# EAGLE design shield-obr (EAGLE 9.6.2)
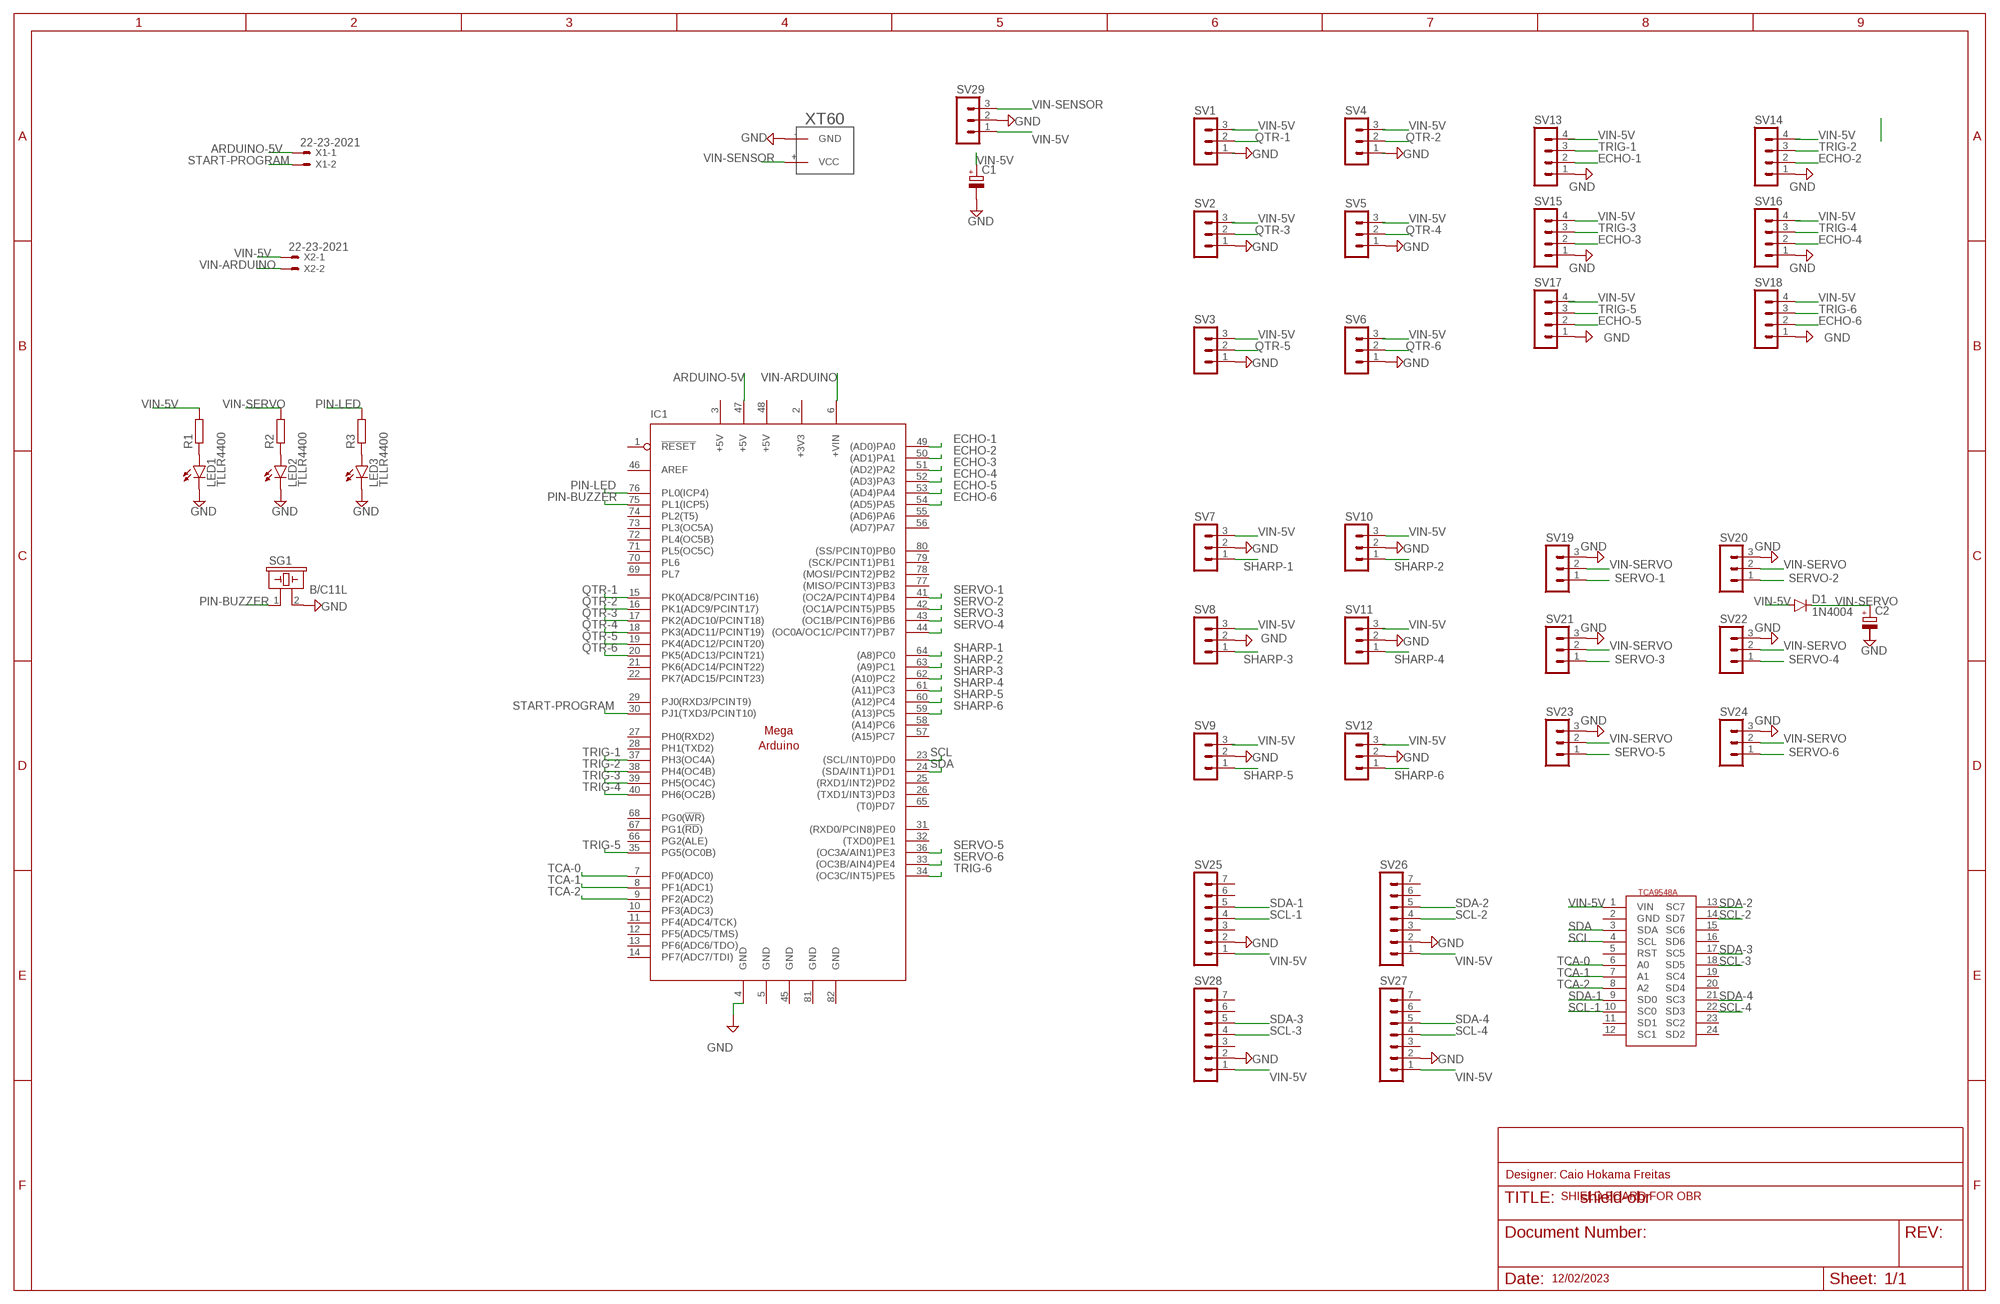
[diagram p0: schematic, sheet 1]

## Parts
C1  CPOL-EUE2.5-5  [E2,5-5]
C2  CPOL-EUE2.5-5  [E2,5-5]
D1  1N4004  [DO41-10]
IC1  MEGAARDUINO_1  [MEGA_ARDUINO]
LED1  TLLR4400  [LED3MM]
LED2  TLLR4400  [LED3MM]
LED3  TLLR4400  [LED3MM]
R1  R-EU_0207/10  [0207/10]
R2  R-EU_0207/10  [0207/10]
R3  R-EU_0207/10  [0207/10]
SG1  B/C11L  [B/C11L]
SV1  MA03-1  [MA03-1]
SV2  MA03-1  [MA03-1]
SV3  MA03-1  [MA03-1]
SV4  MA03-1  [MA03-1]
SV5  MA03-1  [MA03-1]
SV6  MA03-1  [MA03-1]
SV7  MA03-1  [MA03-1]
SV8  MA03-1  [MA03-1]
SV9  MA03-1  [MA03-1]
SV10  MA03-1  [MA03-1]
SV11  MA03-1  [MA03-1]
SV12  MA03-1  [MA03-1]
SV13  MA04-1  [MA04-1]
SV14  MA04-1  [MA04-1]
SV15  MA04-1  [MA04-1]
SV16  MA04-1  [MA04-1]
SV17  MA04-1  [MA04-1]
SV18  MA04-1  [MA04-1]
SV19  MA03-1  [MA03-1]
SV20  MA03-1  [MA03-1]
SV21  MA03-1  [MA03-1]
SV22  MA03-1  [MA03-1]
SV23  MA03-1  [MA03-1]
SV24  MA03-1  [MA03-1]
SV25  MA07-1  [MA07-1]
SV26  MA07-1  [MA07-1]
SV27  MA07-1  [MA07-1]
SV28  MA07-1  [MA07-1]
SV29  MA03-1  [MA03-1]
U$2  XT60  [XT60]
U$3  TCA9548A  [TCA9548A]
X1  22-23-2021  [22-23-2021]
X2  22-23-2021  [22-23-2021]

## Nets
ARDUINO-5V: IC1.47(+5V) X1.1
ECHO-1: IC1.49((AD0)PA0) SV13.2
ECHO-2: IC1.50((AD1)PA1) SV14.2
ECHO-3: IC1.51((AD2)PA2) SV15.2
ECHO-4: IC1.52((AD3)PA3) SV16.2
ECHO-5: IC1.53((AD4)PA4) SV17.2
ECHO-6: IC1.54((AD5)PA5) SV18.2
GND: C1.- IC1.4(GND) LED1.K(C) LED2.K(C) LED3.K(C) SG1.2 SV1.1 SV2.1 SV3.1 SV4.1 SV5.1 SV6.1 SV7.2 SV8.2 SV9.2 SV10.2 SV11.2 SV12.2 SV13.1 SV14.1 SV15.1 SV16.1 SV17.1 SV18.1 SV19.3 SV20.3 SV21.3 SV22.3 SV23.3 SV24.3 SV25.2 SV26.2 SV27.2 SV28.2 SV29.2 U$2.-(GND)
N$1: LED1.A R1.1
N$2: LED2.A R2.1
N$3: LED3.A R3.1
PIN-BUZZER: IC1.75(PL1(ICP5)) SG1.1
PIN-LED: IC1.76(PL0(ICP4)) R3.2
QTR-1: IC1.15(PK0(ADC8/PCINT16)) SV1.2
QTR-2: IC1.16(PK1(ADC9/PCINT17)) SV4.2
QTR-3: IC1.17(PK2(ADC10/PCINT18)) SV2.2
QTR-4: IC1.18(PK3(ADC11/PCINT19)) SV5.2
QTR-5: IC1.19(PK4(ADC12/PCINT20)) SV3.2
QTR-6: IC1.20(PK5(ADC13/PCINT21)) SV6.2
SCL: IC1.23((SCL/INT0)PD0) U$3.4(SCL)
SCL-1: SV25.4 U$3.10(SC0)
SCL-2: SV26.4 U$3.14(SD7)
SCL-3: SV28.4 U$3.18(SD5)
SCL-4: SV27.4 U$3.22(SD3)
SDA: IC1.24((SDA/INT1)PD1) U$3.3(SDA)
SDA-1: SV25.5 U$3.9(SD0)
SDA-2: SV26.5 U$3.13(SC7)
SDA-3: SV28.5 U$3.17(SC5)
SDA-4: SV27.5 U$3.21(SC3)
SERVO-1: IC1.41((OC2A/PCINT4)PB4) SV19.1
SERVO-2: IC1.42((OC1A/PCINT5)PB5) SV20.1
SERVO-3: IC1.43((OC1B/PCINT6)PB6) SV21.1
SERVO-4: IC1.44((OC0A/OC1C/PCINT7)PB7) SV22.1
SERVO-5: IC1.36((OC3A/AIN1)PE3) SV23.1
SERVO-6: IC1.33((OC3B/AIN4)PE4) SV24.1
SHARP-1: IC1.64((A8)PC0) SV7.1
SHARP-2: IC1.63((A9)PC1) SV10.1
SHARP-3: IC1.62((A10)PC2) SV8.1
SHARP-4: IC1.61((A11)PC3) SV11.1
SHARP-5: IC1.60((A12)PC4) SV9.1
SHARP-6: IC1.59((A13)PC5) SV12.1
START-PROGRAM: IC1.30(PJ1(TXD3/PCINT10)) X1.2
TCA-0: IC1.7(PF0(ADC0)) U$3.6(A0)
TCA-1: IC1.8(PF1(ADC1)) U$3.7(A1)
TCA-2: IC1.9(PF2(ADC2)) U$3.8(A2)
TRIG-1: IC1.37(PH3(OC4A)) SV13.3
TRIG-2: IC1.38(PH4(OC4B)) SV14.3
TRIG-3: IC1.39(PH5(OC4C)) SV15.3
TRIG-4: IC1.40(PH6(OC2B)) SV16.3
TRIG-5: IC1.35(PG5(OC0B)) SV17.3
TRIG-6: IC1.34((OC3C/INT5)PE5) SV18.3
VIN-5V: C1.+ D1.A R1.2 SV1.3 SV2.3 SV3.3 SV4.3 SV5.3 SV6.3 SV7.3 SV8.3 SV9.3 SV10.3 SV11.3 SV12.3 SV13.4 SV14.4 SV15.4 SV16.4 SV17.4 SV18.4 SV25.1 SV26.1 SV27.1 SV28.1 SV29.1 U$3.1(VIN) X2.1
VIN-ARDUINO: IC1.6(+VIN) X2.2
VIN-SENSOR: SV29.3 U$2.+(VCC)
VIN-SERVO: C2.+ D1.C R2.2 SV19.2 SV20.2 SV21.2 SV22.2 SV23.2 SV24.2
Unconnected: C2.- IC1.1(!RESET) IC1.10(PF3(ADC3)) IC1.11(PF4(ADC4/TCK)) IC1.12(PF5(ADC5/TMS)) IC1.13(PF6(ADC6/TDO)) IC1.14(PF7(ADC7/TDI)) IC1.21(PK6(ADC14/PCINT22)) IC1.22(PK7(ADC15/PCINT23)) IC1.25((RXD1/INT2)PD2) IC1.26((TXD1/INT3)PD3) IC1.27(PH0(RXD2)) IC1.28(PH1(TXD2)) IC1.29(PJ0(RXD3/PCINT9)) IC1.31((RXD0/PCIN8)PE0) IC1.32((TXD0)PE1) IC1.46(AREF) IC1.55((AD6)PA6) IC1.56((AD7)PA7) IC1.57((A15)PC7) IC1.58((A14)PC6) IC1.65((T0)PD7) IC1.66(PG2(ALE)) IC1.67(PG1(!RD!)) IC1.68(PG0(!WR!)) IC1.69(PL7) IC1.70(PL6) IC1.71(PL5(OC5C)) IC1.72(PL4(OC5B)) IC1.73(PL3(OC5A)) IC1.74(PL2(T5)) IC1.77((MISO/PCINT3)PB3) IC1.78((MOSI/PCINT2)PB2) IC1.79((SCK/PCINT1)PB1) IC1.80((SS/PCINT0)PB0) SV25.3 SV25.6 SV25.7 SV26.3 SV26.6 SV26.7 SV27.3 SV27.6 SV27.7 SV28.3 SV28.6 SV28.7 U$3.2(GND) U$3.5(RST) U$3.11(SD1) U$3.12(SC1) U$3.15(SC6) U$3.16(SD6) U$3.19(SC4) U$3.20(SD4) U$3.23(SC2) U$3.24(SD2)

## Notes on the sheet
- Designer: Caio Hokama Freitas
- SHIELD BOARD FOR OBR
- 12/02/2023

## Power pins joined to a net without a drawn wire
+3V3: IC1.2(+3V3)
+5V: IC1.3(+5V) IC1.48(+5V)
GND: IC1.5(GND) IC1.45(GND) IC1.81(GND) IC1.82(GND)

## Library data of the parts
C1 C2 = rcl:CPOL-EU: POLARIZED CAPACITOR, European symbol; SPICEPREFIX: C
D1 = diode:1N4004: DIODE general purpose rectifier, 1 A
IC1 = arduino:MEGAARDUINO_1: The Arduino Mega is a microcontroller board based on the ATmega1280. - 54 digital input/output pins (of which 14 can be used as PWM outputs) - 16 analog inputs - 4 UARTs (hardware serial ports) - 16 MHz crystal oscillator - USB connection - power jack - ICSP header - reset button It contains everything needed to support the microcontroller; simply connect it to a computer with a USB cable or power it with a AC-to-DC adapter or battery to get started. The Mega is compatible with most shields designed for the Arduino Duemilanove or Diecimila. http://arduino.cc/en/Main/ArduinoBoardMega
LED1-LED3 = led:TLLR4400: Low Current (2mA) LED 3 mm Tinted Diffused Package color RED Source: Data sheet <http://www.farnell.com/datasheets/391100.pdf>; MF: VISHAY SEMICONDUCTOR; OC_FARNELL: 1612437
R1-R3 = rcl:R-EU_: RESISTOR, European symbol; SPICEPREFIX: R
SG1 = buzzer:B/C11L: BUZZER Source: Buerklin; OC_FARNELL: unknown; OC_NEWARK: unknown
SV1-SV12 SV19-SV24 SV29 = con-lstb:MA03-1: PIN HEADER; OC_FARNELL: unknown; OC_NEWARK: unknown
SV13-SV18 = con-lstb:MA04-1: PIN HEADER; OC_FARNELL: unknown; OC_NEWARK: unknown
SV25-SV28 = con-lstb:MA07-1: PIN HEADER; OC_FARNELL: unknown; OC_NEWARK: unknown
U$2 = XT60:XT60: XT60
U$3 = TCA9548A:TCA9548A
X1 X2 = con-molex:22-23-2021: .100" (2.54mm) Center Header - 2 Pin; MF: MOLEX; MPN: 22-23-2021; OC_FARNELL: 1462926; OC_NEWARK: 25C3832

## Board
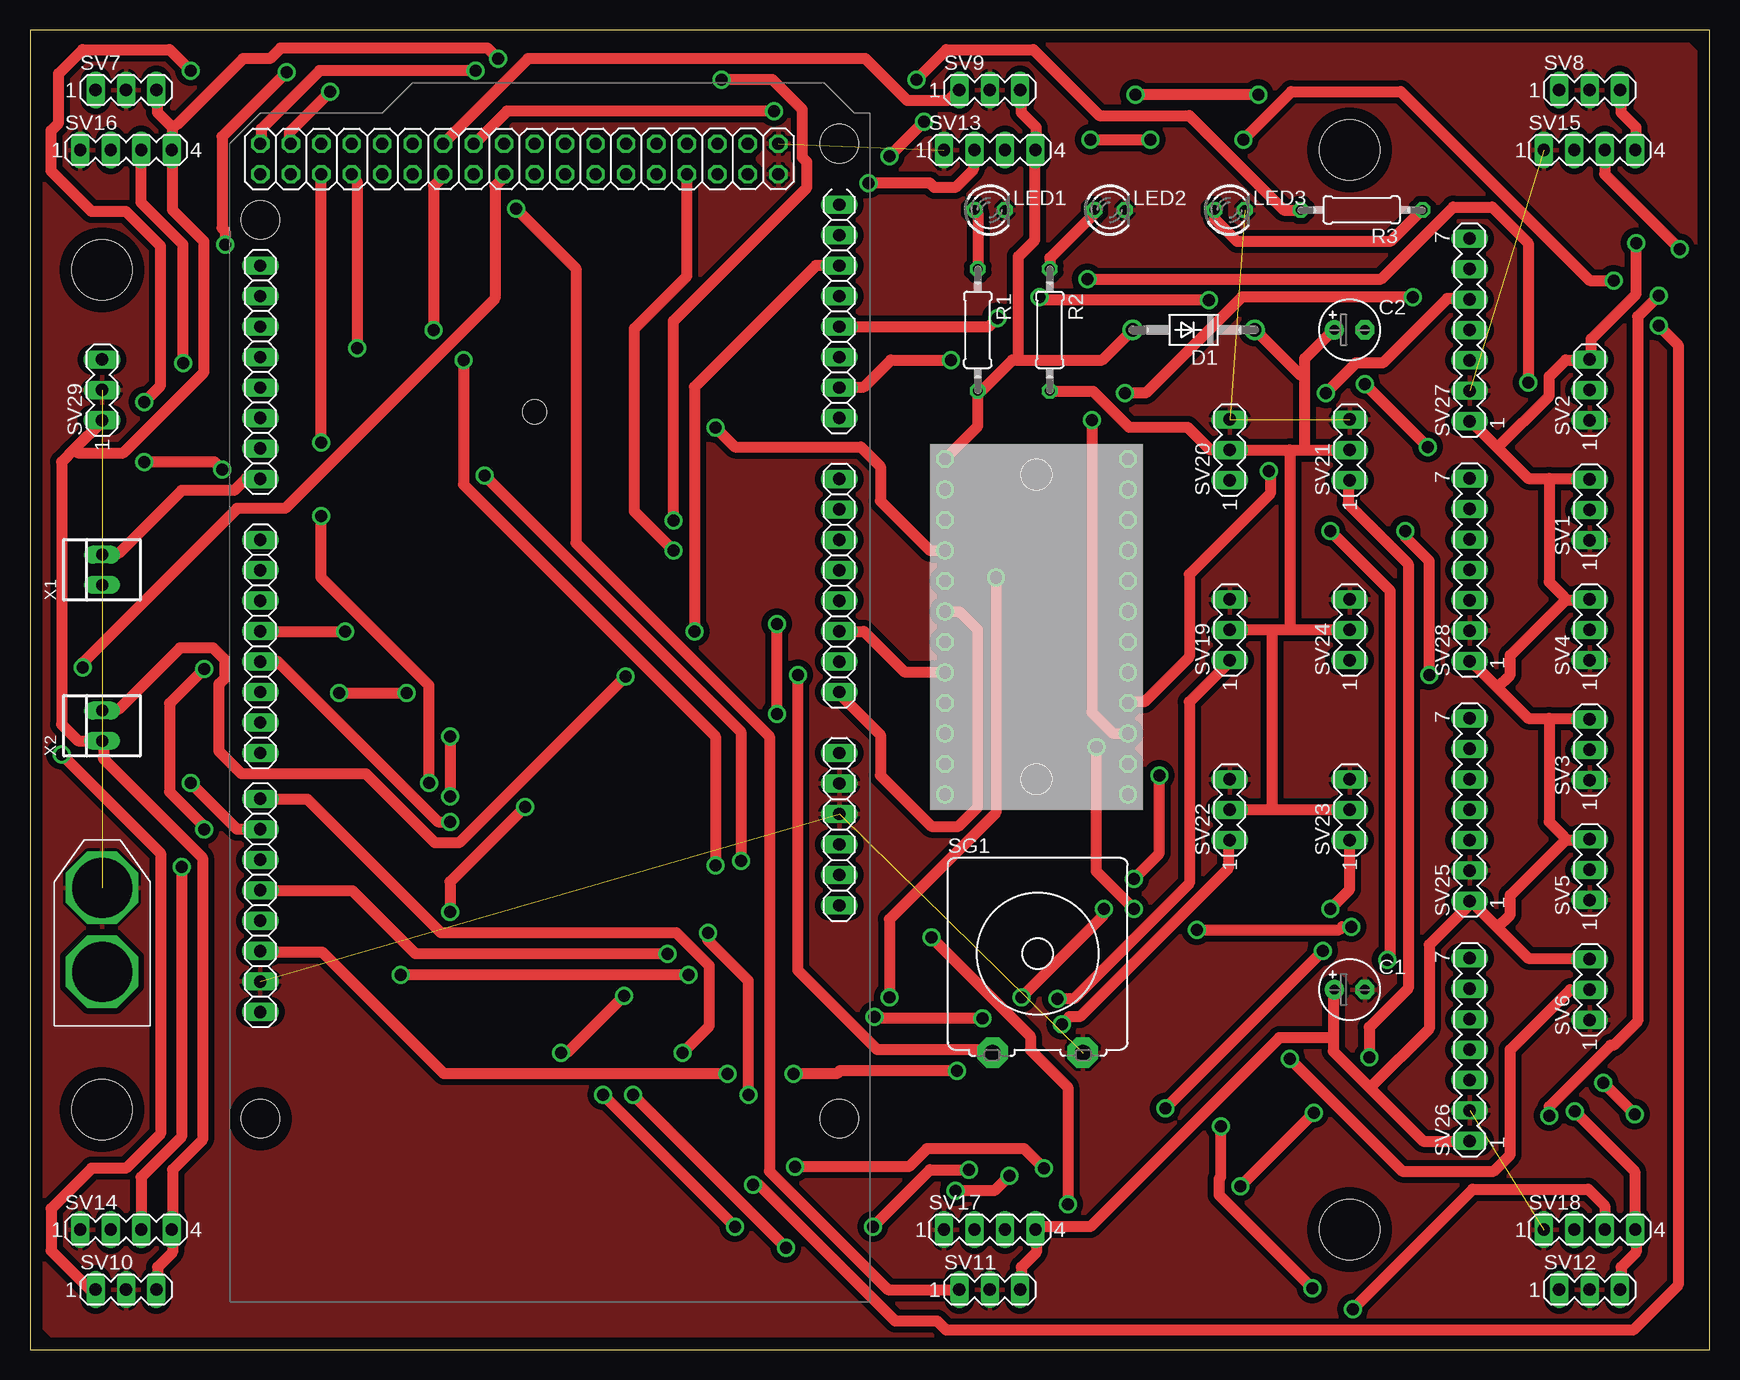
[diagram p1: board, top side]
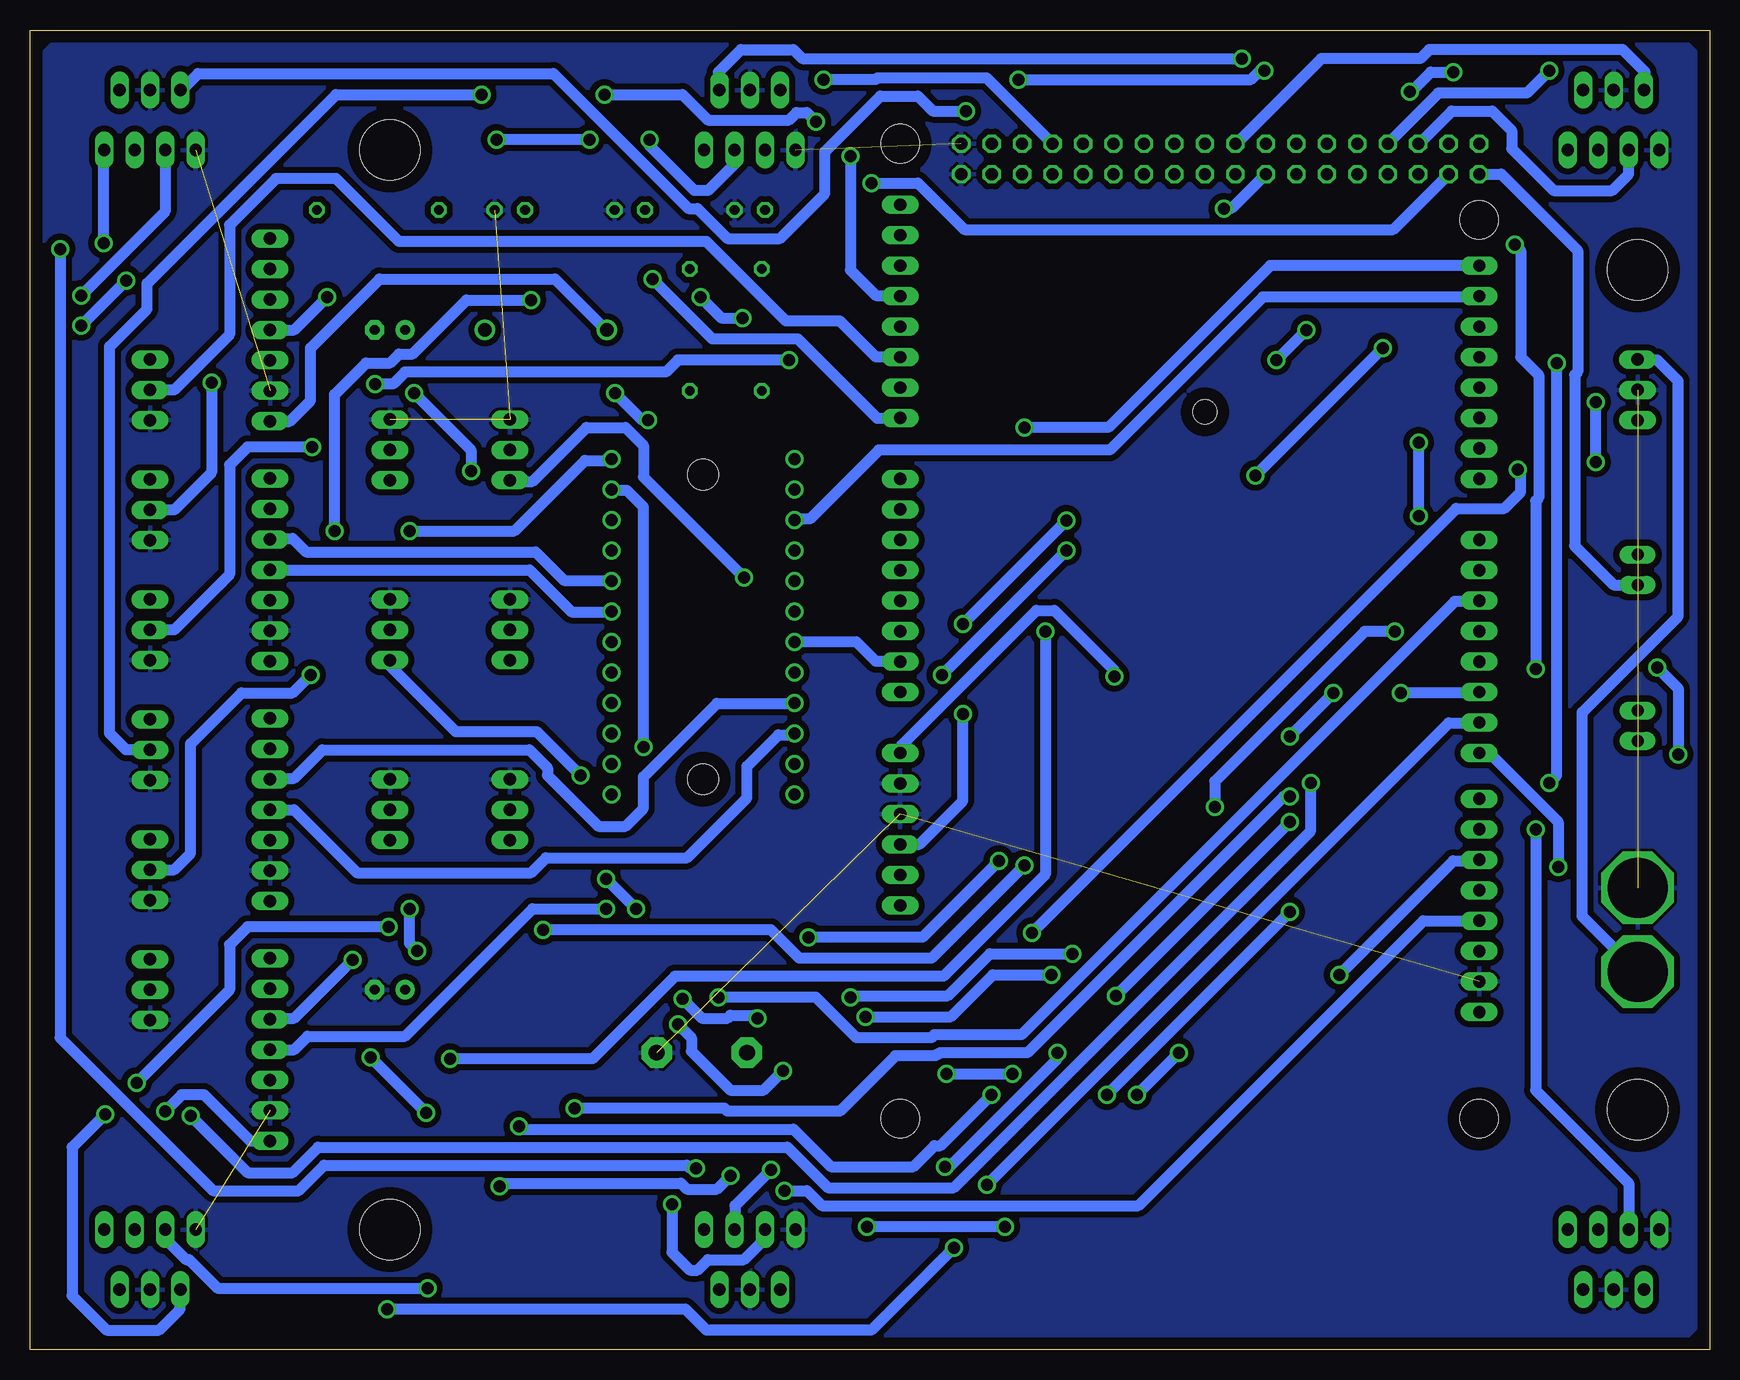
[diagram p2: board, bottom side, seen from below]

Size 140 x 110 mm. Coordinates in mm from the lower left corner, seen from the top.
Outline: 0,0 140,0 140,110 0,110 0,0
Copper layers (1*16): Top 0.035mm / dielectric 1.5mm / Bottom 0.035mm
Design rules "default *": minimum track width 0.9mm, minimum drill 1mm, track to track 20mil, track to pad 20mil, pad to pad 20mil, via to via 20mil, smd to smd 10mil, copper to edge 40mil, drill to drill 6mil, minimum pad ring 10mil, minimum via ring 8mil, stop-mask expansion 4mil, vias tented up to drill 0mil, thermal gap 10mil
Holes 5 mm at 110,10 110,100 6,90 6,20

### Footprints (pad centres in the part's own frame; a part is rotated, then mirrored left to right if it is on the bottom)
E2,5-5 = drill 0.813 pad 1.6: + -1.27,0 | drill 0.813 pad 1.6 octagon: - 1.27,0
DO41-10 = drill 1.118: A 5.08,0; C -5.08,0
MEGA_ARDUINO = drill 1.016 long: 1 33.02,2.54; 2 35.56,2.54; 3 38.1,2.54; 4 40.64,2.54; 5 43.18,2.54; 6 45.72,2.54; 7 50.8,2.54; 8 53.34,2.54; 9 55.88,2.54; 10 58.42,2.54; 11 60.96,2.54; 12 63.5,2.54; 13 66.04,2.54; 14 68.58,2.54; 15 73.66,2.54; 16 76.2,2.54; 17 78.74,2.54; 18 81.28,2.54; 19 83.82,2.54; 20 86.36,2.54; 21 88.9,2.54; 22 91.44,2.54; 23 86.36,50.8; 24 83.82,50.8; 25 81.28,50.8; 26 78.74,50.8; 27 76.2,50.8; 28 73.66,50.8; 29 71.12,50.8; 30 68.58,50.8; 31 63.5,50.8; 32 60.96,50.8; 33 58.42,50.8; 34 55.88,50.8; 35 53.34,50.8; 36 50.8,50.8; 37 48.26,50.8; 38 45.72,50.8; 39 41.91,50.8; 40 39.37,50.8; 41 36.83,50.8; 42 34.29,50.8; 43 31.75,50.8; 44 29.21,50.8; 45 26.67,50.8; 46 24.13,50.8 | drill 1.016 octagon: 47 93.98,50.8; 48 96.52,50.8; 49 93.98,48.26; 50 96.52,48.26; 51 93.98,45.72; 52 96.52,45.72; 53 93.98,43.18; 54 96.52,43.18; 55 93.98,40.64; 56 96.52,40.64; 57 93.98,38.1; 58 96.52,38.1; 59 93.98,35.56; 60 96.52,35.56; 61 93.98,33.02; 62 96.52,33.02; 63 93.98,30.48; 64 96.52,30.48; 65 93.98,27.94; 66 96.52,27.94; 67 93.98,25.4; 68 96.52,25.4; 69 93.98,22.86; 70 96.52,22.86; 71 93.98,20.32; 72 96.52,20.32; 73 93.98,17.78; 74 96.52,17.78; 75 93.98,15.24; 76 96.52,15.24; 77 93.98,12.7; 78 96.52,12.7; 79 93.98,10.16; 80 96.52,10.16; 81 93.98,7.62; 82 96.52,7.62 | hole 3.2: 15.24,50.8; 15.24,2.54; 90.17,50.8; 96.52,2.54 | hole 2: 74.168,27.94
LED3MM = drill 0.813 octagon: A -1.27,0; K 1.27,0
0207/10 = drill 0.813 octagon: 1 -5.08,0; 2 5.08,0
B/C11L = drill 1.321 pad 2.54 octagon: 1 -3.759,-8.255; 2 3.759,-8.255
MA03-1 = drill 1.016 long: 1 -2.54,0; 2 0,0; 3 2.54,0
MA04-1 = drill 1.016 long: 1 -3.81,0; 2 -1.27,0; 3 1.27,0; 4 3.81,0
MA07-1 = drill 1.016 long: 1 -7.62,0; 2 -5.08,0; 3 -2.54,0; 4 0,0; 5 2.54,0; 6 5.08,0; 7 7.62,0
XT60 = drill 5 octagon: + 4.5,0; - 11.5,0
TCA9548A = drill 1.001: 1 1.276,29.216; 2 1.276,26.676; 3 1.276,24.136; 4 1.276,21.596; 5 1.276,19.056; 6 1.276,16.516; 7 1.276,13.976; 8 1.276,11.436; 9 1.276,8.896; 10 1.276,6.356; 11 1.276,3.816; 12 1.276,1.276; 13 16.516,29.216; 14 16.516,26.676; 15 16.516,24.136; 16 16.516,21.596; 17 16.516,19.056; 18 16.516,16.516; 19 16.516,13.976; 20 16.516,11.436; 21 16.516,8.896; 22 16.516,6.356; 23 16.516,3.816; 24 16.516,1.276 | hole 2.54: 8.89,2.54; 8.89,27.94
22-23-2021 = drill 1 long: 1 -1.27,0; 2 1.27,0

### Placement (x,y rotation side)
C1  110,30 0 top
C2  110,85 0 top
D1  97,85 180 top
IC1  70,4 90 top
LED1  80,95 0 top
LED2  90,95 0 top
LED3  100,95 0 top
R1  79,85 270 top
R2  85,85 270 top
R3  111,95 180 top
SG1  84,33 0 top
SV1  130,70 90 top
SV2  130,80 90 top
SV3  130,50 90 top
SV4  130,60 90 top
SV5  130,40 90 top
SV6  130,30 90 top
SV7  8,105 0 top
SV8  130,105 0 top
SV9  80,105 0 top
SV10  8,5 0 top
SV11  80,5 0 top
SV12  130,5 0 top
SV13  80,100 0 top
SV14  8,10 0 top
SV15  130,100 0 top
SV16  8,100 0 top
SV17  80,10 0 top
SV18  130,10 0 top
SV19  100,60 90 top
SV20  100,75 90 top
SV21  110,75 90 top
SV22  100,45 90 top
SV23  110,45 90 top
SV24  110,60 90 top
SV25  120,45 90 top
SV26  120,25 90 top
SV27  120,85 90 top
SV28  120,65 90 top
SV29  6,80 90 top
U$2  6,27 90 top
U$3  75,45 0 top
X1  6,65 90 top
X2  6,52 90 top

### Tracks (layer width: path | path; a pad name or v marks a point on that pad's centre or on a via)
+5V  (via drill 1)
  Top 0.9: v37.12,106.62 24.12,106.62 19.25,101.75 19.25,100.62 IC1.48 | v57.62,105.88 61.88,105.88 64.38,103.38 64.38,99.38 64.75,99 64.75,96.88 53.62,85.75 v53.62,69.12 | v62.25,53 v62.25,60.5
  Bottom 0.9: v37.12,106.62 37.5,106.62 38.25,105.88 v57.62,105.88 | v62.25,60.5 v53.62,69.12 | v62.25,53 62.25,45.75 65.88,42.12 67.38,42.12 IC1.3
ARDUINO-5V
  Bottom 0.9: X1.1 6,63.75 8,63.75 11.25,67 11.25,81.25 11,81.5 11,91.62 17.38,98 19.12,98 IC1.47
ECHO-1  (via drill 1)
  Top 0.9: v69.88,97.25 75,97.25 75.38,96.88 77.12,96.88 78.62,98.38 78.62,100 SV13.2
  Bottom 0.9: v69.88,97.25 66,97.25 62.12,93.38 26.38,93.38 21.88,97.88 21.75,97.88 IC1.49
ECHO-2  (via drill 1)
  Top 0.9: v14.5,43.38 14.5,43.62 11.62,46.5 11.62,53.88 v14.5,56.75 | v16.25,92.12 16.25,93.25 16,93.5 16,101.12 v21.38,106.5 | v25,104.88 21.62,101.5 21.62,100.62 IC1.50
  Bottom 0.9: v14.5,43.38 14.5,21.62 6.75,13.88 6.75,10 SV14.2 | v14.5,56.75 14.5,70.75 14.25,71 14.25,81.25 15.75,82.75 15.75,91.62 v16.25,92.12 | v21.38,106.5 23.25,106.5 24.88,104.88 v25,104.88
ECHO-3  (via drill 1)
  Top 0.9: v24.25,75.62 24.25,97.88 IC1.51 | v24.25,69.5 24.25,64.38 33.25,55.38 v33.25,47.25 | v126.62,19.5 126.62,20.25 131.75,25.38 132,25.38 134,27.38 134,86.12 v135.75,87.88
  Bottom 0.9: v24.25,69.5 v24.25,75.62 | v33.25,47.25 33.25,43.25 63,13.5 73.5,13.5 76.88,16.88 116,16.88 118.12,14.75 121.88,14.75 v126.62,19.5 | v135.75,87.88 128.75,94.88 128.75,100 SV15.2
ECHO-4
  Bottom 0.9: SV16.2 6.75,100 6.75,98 8.12,96.62 13,96.62 16.5,100.12 16.5,101.62 18.12,103.25 21.5,103.25 24.25,100.5 IC1.52
ECHO-5  (via drill 1)
  Top 0.9: v86.5,12.12 86.5,21.88 83.38,25 83.38,26.12 v75.12,34.38 | v59.25,40.75 59.25,51.5 v37.88,72.88 | v27.25,83.5 27.25,97.38 26.75,97.88 IC1.53
  Bottom 0.9: v86.5,12.12 86.5,8.12 85,6.62 84.38,6.62 83.5,7.5 80.5,7.5 78.75,9.25 78.75,10 SV17.2 | v75.12,34.38 65.62,34.38 v59.25,40.75 | v27.25,83.5 v37.88,72.88
ECHO-6  (via drill 1)
  Top 0.9: v13.38,106.62 11.62,108.38 4.38,108.38 2.38,106.38 2.38,102.25 1.75,101.62 1.75,98.25 5.12,94.88 8,94.88 10.88,92 10.88,80.38 v9.5,79 | v9.5,74 15.38,74 v16,73.38 | v56.5,34.75 56.5,34.12 59.88,30.75 v59.88,21.25 | v99.25,18.62 99.25,14.38 99.12,14.25 99.12,12.88 v106.88,5.12
  Bottom 0.9: v13.38,106.62 15.25,104.75 22.62,104.75 26.75,100.62 IC1.54 | v9.5,74 v9.5,79 | v16,73.38 15.75,73.12 15.75,71.5 17.12,70.12 21.12,70.12 v56.5,34.75 | v59.88,21.25 64.12,17 64.62,17 66.38,15.25 73.25,15.25 76.38,18.38 99,18.38 v99.25,18.62 | v106.88,5.12 124.38,5.12 126.75,7.5 127,7.5 128.62,9.12 128.62,10 SV18.2
GND  (8 unrouted)
  pour Top: 1,108 2,109 138,109 139,108 139,2 138,1 2,1 1,2
  pour Bottom: 1,108 2,109 138,109 139,108 139,2 138,1 2,1 1,2
N$1
  Top 0.9: R1.1 79,94.75 78.75,95 LED1.A
N$2
  Top 0.9: R2.1 85,91 88.75,94.75 88.75,95 LED2.A
N$3
  Top 0.9: LED3.A 98.75,95 98.75,94.25 100.62,92.38 113.38,92.38 116,95 R3.1
PIN-BUZZER  (via drill 1)
  Top 0.9: v53.62,66.62 50.38,69.88 50.38,85.12 54.75,89.5 54.75,97.88 IC1.75 | v64,56.25 64,31.62 70.62,25 79.88,25 80.12,24.75 SG1.1
  Bottom 0.9: v64,56.25 v53.62,66.62
PIN-LED  (via drill 1)
  Top 0.9: R3.2 104.5,95 96.62,102.88 89.12,102.88 83.62,108.38 76.38,108.38 v73.88,105.88
  Bottom 0.9: v73.88,105.88 69.5,105.88 69.38,106 60.25,106 54.88,100.62 IC1.76
QTR-1  (via drill 1)
  Top 0.9: v124.88,80.62 124.88,92.25 121.88,95.25 118.62,95.25 112.62,89.25 v88.12,89.25
  Bottom 0.9: SV1.2 128,70 124.88,73.12 v124.88,80.62 | v88.12,89.25 83.12,84.25 76,84.25 69.38,77.62 67.5,77.62 IC1.15
QTR-2  (via drill 1)
  Top 0.9: v111.25,80.5 v116.5,75.25 | v76.75,82.5 71.75,82.5 69.5,80.25 67.5,80.25 IC1.16
  Bottom 0.9: SV4.2 128,60 123.38,64.62 123.38,73.75 121.88,75.25 v116.5,75.25 | v111.25,80.5 109.75,80.5 108.75,81.5 87,81.5 86,82.5 v76.75,82.5
QTR-3
  Bottom 0.9: SV2.2 128,80 123.38,84.62 123.38,93.75 119.5,97.62 114.5,97.62 109.25,92.38 83.62,92.38 77,85.75 72.5,85.75 69.5,82.75 67.5,82.75 IC1.17
QTR-4  (via drill 1)
  Top 0.9: v80.62,86 79.88,85.25 67.5,85.25 IC1.18 | v84.12,87.75 84.38,87.5 v98.25,87.5 | v114.62,68.25 114.62,67.75 116.62,65.75 v116.62,56.25
  Bottom 0.9: v80.62,86 82.38,86 v84.12,87.75 | v98.25,87.5 103.62,87.5 108.12,83 109.25,83 110,82.25 112,82.25 114.62,79.62 v114.62,68.25 | v116.62,56.25 118.12,54.75 122.38,54.75 126.62,50.5 126.62,41.38 128,40 SV5.2
QTR-5  (via drill 1)
  Top 0.9: v74.5,102.38 v71.62,99.5 | v102.38,104.62 v92.12,104.62
  Bottom 0.9: v71.62,99.5 71.62,90 69.5,87.88 67.5,87.88 IC1.19 | v74.5,102.38 75.25,103.12 76.12,103.12 76.75,102.5 83.5,102.5 85.62,104.62 v92.12,104.62 | v102.38,104.62 114.5,104.62 130.25,88.88 130.25,86.75 133.38,83.62 133.38,51.38 132,50 SV3.2
QTR-6  (via drill 1)
  Top 0.9: SV6.2 128.38,30 123.38,25 123.38,16.25 122,14.88 114.38,14.88 v105,24.25 | v55.38,59.88 55.38,80.25 65.5,90.38 67.38,90.38 IC1.20
  Bottom 0.9: v105,24.25 93.12,24.25 86.25,31.12 63.88,31.12 55.38,39.62 v55.38,59.88
SCL  (via drill 1)
  Top 0.9: v57.12,76.88 58.75,75.25 69.25,75.25 70.88,73.62 70.88,70.75 75,66.62 76.25,66.62 U$3.4
  Bottom 0.9: v57.12,76.88 50.12,76.88 36.62,90.38 19.25,90.38 IC1.23
SCL-1
  Bottom 0.9: SV25.4 118,45 112.75,39.75 98.25,39.75 97,41 85.25,41 80.25,46 80.25,48.62 77.62,51.25 76.38,51.25 U$3.10
SCL-2  (via drill 1)
  Top 0.9: v88.88,50.25 88.88,39.88 v92,36.75
  Bottom 0.9: v88.88,50.25 88.88,70.25 90.25,71.62 91.5,71.62 U$3.14 | v92,36.75 98.12,36.75 108.75,26.12 116.88,26.12 118,25 SV26.4
SCL-3
  Bottom 0.9: SV28.4 98.38,65 94.88,61.5 91.62,61.5 U$3.18
SCL-4  (via drill 1)
  Top 0.9: v88.5,77.5 88.5,53.12 90.25,51.38 91.5,51.38 U$3.22 | v91.25,79.75 93,79.75 101,87.75 v115.25,87.75
  Bottom 0.9: v88.5,77.5 89,77.5 v91.25,79.75 | v115.25,87.75 118,85 SV27.4
SDA
  Bottom 0.9: U$3.3 76.25,69.25 75,69.25 69.25,75 50,75 37.25,87.75 19.25,87.75 IC1.24
SDA-1
  Bottom 0.9: U$3.9 76.38,53.88 82.75,53.88 88.88,47.75 88.88,45.12 90.38,43.62 92.62,43.62 96.88,47.88 96.88,48.5 98.38,50 115.62,50 118,47.62 120,47.62 SV25.5
SDA-2  (via drill 1)
  Top 0.9: v108.38,68.25 113.38,63.25 113.38,32.75 v113.12,32.5
  Bottom 0.9: v108.38,68.25 99.62,68.25 93.75,74.12 91.62,74.12 U$3.13 | v113.12,32.5 118,27.62 120,27.62 SV26.5
SDA-3
  Bottom 0.9: U$3.17 91.62,64.12 95.5,64.12 97.88,66.5 117,66.5 118.12,67.62 120,67.62 SV28.5
SDA-4  (via drill 1)
  Top 0.9: v103.25,73.25 103.38,73.12 103.38,71.38 96.62,64.62 96.62,57.75 92.88,54 91.62,54 U$3.21 | v108,79.75 110.5,82.25 112.75,82.25 118.12,87.62 120,87.62 SV27.5
  Bottom 0.9: v103.25,73.25 103.25,75 v108,79.75
SERVO-1  (via drill 1)
  Top 0.9: v54.88,31.25 v30.88,31.25 | v70.38,27.75 70.88,27.75 71,27.62 v79.38,27.62 | v85.62,29.25 87,29.25 96.62,38.88 96.62,54 100,57.38 SV19.1
  Bottom 0.9: v30.88,31.25 21.38,40.75 19.25,40.75 IC1.41 | v54.88,31.25 59.75,31.25 63.25,27.75 v70.38,27.75 | v79.38,27.62 79.62,27.88 81.62,27.88 81.88,27.62 84,27.62 v85.62,29.25
SERVO-2  (via drill 1)
  Top 0.9: v53.12,33 32.12,33 26.88,38.25 19.25,38.25 IC1.42 | v71.62,29.38 71.62,35.88 80.5,44.75 v80.5,64.38
  Bottom 0.9: v53.12,33 60,33 63.5,29.5 71.5,29.5 v71.62,29.38 | v80.5,64.38 88.88,72.75 88.88,75.38 90.38,76.88 93.62,76.88 98.12,72.38 100,72.38 SV20.1
SERVO-3  (via drill 1)
  Top 0.9: v77.12,13.25 80.38,13.25 v81.62,14.5 | v107,19.75 v100.88,13.62 | v111.62,24.38 111.62,26.88 114.88,30.12 114.88,65.5 109.88,70.5 109.88,72.25 110,72.38 SV21.1
  Bottom 0.9: IC1.43 23.88,35.75 47.62,12 74,12 75.25,13.25 v77.12,13.25 | v81.62,14.5 82.75,13.38 85.25,13.38 85.75,13.88 100.62,13.88 v100.88,13.62 | v111.62,24.38 v107,19.75
SERVO-4  (via drill 1)
  Top 0.9: v58.12,23 34.5,23 24.38,33.12 19.25,33.12 IC1.44 | v63.62,23 67.25,23 67.5,23.25 v77.25,23.25 | v86,27.12 86.62,27.75 87.5,27.75 99.88,40.12 99.88,42.25 100,42.38 SV22.1
  Bottom 0.9: v63.62,23 v58.12,23 | v77.25,23.25 78.88,21.62 81.62,21.62 84.88,24.88 84.88,26 v86,27.12
SERVO-5  (via drill 1)
  Top 0.9: SV23.1 110,38.38 v108.38,36.75 | v94.62,20.12 v107.75,33.25 | v35,51.12 v35,46.12 | v25.75,54.75 v31.38,54.75
  Bottom 0.9: v108.38,36.75 108.38,33.88 v107.75,33.25 | v94.62,20.12 82.12,20.12 81.88,19.88 72.5,19.88 67.88,24.5 64.5,24.5 64.38,24.62 64.25,24.62 64.12,24.75 56.88,24.75 35.5,46.12 v35,46.12 | v31.38,54.75 v35,51.12 | v25.75,54.75 19.25,54.75 IC1.36
SERVO-6  (via drill 1)
  Top 0.9: v94.12,47.88 94.12,41.38 v92,39.25 | v89.5,36.75 89.5,36.25 v82.62,29.38
  Bottom 0.9: SV24.1 110,57 104.5,51.5 97.75,51.5 v94.12,47.88 | v89.5,36.75 v92,39.25 | v82.62,29.38 74.5,29.38 71.12,26 64.88,26 64.62,26.25 57.38,26.25 21.25,62.38 19.25,62.38 IC1.33
SHARP-1
  Bottom 0.9: IC1.64 39.5,100.62 39.38,100.62 32.38,107.62 24.12,107.62 23.38,108.38 7.25,108.38 5.38,106.5 5.38,105 SV7.1
SHARP-2  (via drill 1)
  Top 0.9: SV10.1 5,5 1.75,8.25 1.75,11.75 5.12,15.12 8,15.12 10.88,18 10.88,41.38 v2.62,49.62 | v4.38,56.88 4.38,57.25 17.25,70.12 21.25,70.12 38.75,87.62 38.75,97 39.62,97.88 IC1.63
  Bottom 0.9: v2.62,49.62 2.62,55.12 v4.38,56.88
SHARP-3  (via drill 1)
  Top 0.9: v62,103.25 39.75,103.25 37.12,100.62 37,100.62 IC1.62
  Bottom 0.9: v62,103.25 64.75,103.25 66,104.5 69.12,104.5 73.75,99.88 73.75,96.38 77.5,92.62 81.88,92.62 84.38,95.12 85.12,95.12 96.38,106.38 126,106.38 127.38,105 SV8.1
SHARP-4  (via drill 1)
  Top 0.9: SV11.1 71.5,5 61.62,14.88 61.62,51.12 45.5,67.25 45.5,90.12 v40.5,95.12
  Bottom 0.9: v40.5,95.12 39.88,95.12 37,98 IC1.61
SHARP-5
  Top 0.9: IC1.60 34.5,100.62 41.5,107.62 69.62,107.62 73.12,104.12 76.5,104.12 77.38,105 SV9.1
SHARP-6  (via drill 1)
  Top 0.9: v131.12,22.25 v133.75,19.62 | v110.12,35.25 109.38,35.25 109.12,35 v97.25,35 | v57.12,40.38 57.12,51.12 36.12,72.12 v36.12,82.5 | v33.62,85 33.62,97 34.5,97.88 IC1.59
  Bottom 0.9: v133.75,19.62 136.5,16.88 136.5,4.5 133.62,1.62 129.25,1.62 127.5,3.38 127.5,5 SV12.1 | v131.12,22.25 123.38,30 123.38,33.75 121.88,35.25 v110.12,35.25 | v97.25,35 78.25,35 75.88,32.62 64.88,32.62 v57.12,40.38 | v33.62,85 v36.12,82.5
START-PROGRAM
  Top 0.9: X1.2 6,66.38 7.38,66.38 12.62,71.62 17,71.62 18,72.62 19.12,72.62 IC1.30
TCA-0
  Top 0.9: U$3.6 76.38,61.5 77.5,61.5 79,60 79,45.25 77.38,43.62 75.12,43.62 70.88,47.88 70.88,51.25 67.38,54.75 IC1.7
TCA-1
  Bottom 0.9: U$3.7 76.25,59 71.12,59 69.5,57.38 67.5,57.38 IC1.8
TCA-2
  Top 0.9: U$3.8 76.25,56.5 72.88,56.5 69.5,59.88 67.5,59.88 IC1.9
TRIG-1  (via drill 1)
  Top 0.9: v60.25,13.75 60.75,13.75 72.12,2.38 75.62,2.38 76.38,1.62 133.62,1.62 137.38,5.38 137.38,83.75 v135.75,85.38 | v132,89.12 130,89.12 114.25,104.88 105.12,104.88 v101.12,100.88 | v88.38,100.88 v93.38,100.88
  Bottom 0.9: v60.25,13.75 21.75,52.25 19.25,52.25 IC1.37 | v132,89.12 v135.75,85.38 | v93.38,100.88 v101.12,100.88 | v88.38,100.88 88.38,100.38 84.62,96.62 83.5,96.62 81.25,98.88 81.25,100 SV13.3
TRIG-2  (via drill 1)
  Top 0.9: v12.62,40.25 12.62,17.75 9.25,14.38 9.25,10 SV14.3
  Bottom 0.9: v12.62,40.25 12.62,44 18.25,49.62 19.12,49.62 IC1.38
TRIG-3  (via drill 1)
  Top 0.9: v54.38,24.75 56.62,27 56.62,32 53.88,34.75 34.25,34.75 23.12,45.88 19.25,45.88 IC1.39 | v63.75,15.25 73.25,15.25 74.75,16.75 82.88,16.75 v84.5,15.12 | v137.5,91.75 131.25,98 131.25,100 SV15.3
  Bottom 0.9: v54.38,24.75 54.38,24.25 63.38,15.25 v63.75,15.25 | v84.5,15.12 85,15.12 85.25,15.38 115.5,15.38 117.62,13.25 124.75,13.25 137.5,26 v137.5,91.75
TRIG-4  (via drill 1)
  Top 0.9: v12.75,82.25 12.75,92.12 9.25,95.62 9.25,100 SV16.3 | v13.38,47.25 17.25,43.38 19.12,43.38 IC1.40
  Bottom 0.9: v12.75,82.25 12.75,47.88 v13.38,47.25
TRIG-5  (via drill 1)
  Top 0.9: v78.25,15 75,15 v70.25,10.25 | v47.75,21.25 v58.75,10.25 | v44.25,24.75 44.75,24.75 v49.5,29.5 | v35,44 34,44 20.62,57.38 19.25,57.38 IC1.35
  Bottom 0.9: v78.25,15 81.25,12 81.25,10 SV17.3 | v58.75,10.25 v70.25,10.25 | v44.25,24.75 v47.75,21.25 | v35,44 v49.5,29.5
TRIG-6  (via drill 1)
  Top 0.9: v110.25,3.38 120.25,13.38 129.88,13.38 131.25,12 131.25,10 SV18.3 | v50.25,21.25 v63,8.5 | v35,36.5 35,39 v41.25,45.25 | v26.25,59.88 19.25,59.88 IC1.34
  Bottom 0.9: v110.25,3.38 85.38,3.38 83.62,1.62 69.88,1.62 v63,8.5 | v35,36.5 v50.25,21.25 | v41.25,45.25 41.25,47.38 28.75,59.88 v26.25,59.88
VIN-5V  (via drill 1)
  Top 0.9: 11.88,101.88 10.62,103.12 10.62,105 SV7.3 | 11.88,101.88 11.88,100 SV16.4 11.88,99.62 11.88,95 14.5,92.38 14.5,81.5 7.75,74.75 4,74.75 3.69,75.06 | SV10.3 10.62,5 10.62,6.88 11.88,8.12 11.88,10 SV14.4 11.88,10.38 11.88,15 14.38,17.5 14.38,41 6.12,49.25 6.12,50.38 X2.1 6,50.75 4,50.75 2.62,52.12 2.62,74 3.69,75.06 | 3.69,75.06 6,77.38 SV29.1 | SV12.3 132.62,5 132.62,6.88 133.88,8.12 133.88,10 SV18.4 133.75,10.38 133.75,14.88 v128.75,19.88 | SV11.3 82.62,5 82.62,6.88 83.88,8.12 83.88,10 SV17.4 84.25,10.25 88.38,10.25 104.12,26 108.62,26 | 111.69,21.81 108.62,24.88 108.62,26 | 111.69,21.81 116.12,17.38 SV26.1 | 108.62,26 108.62,30 C1.+ | SV9.3 82.62,105 82.62,103.12 83.88,101.88 83.88,100 SV13.4 83.75,99.62 83.75,92.5 82.38,91.12 82.38,82.5 | U$3.1 76.25,74.25 79,77 R1.2 79.38,80 81.88,82.5 82.38,82.5 | 82.38,82.5 89.38,82.5 91.88,85 D1.A | 122.31,35.19 120,37.5 SV25.1 119.88,37 116.62,33.75 116.62,26.75 111.69,21.81 | 122.31,35.19 124.88,32.62 130,32.62 SV6.3 | 128,42.5 130,42.5 SV5.3 | 128,42.5 123.38,37.88 123.38,36.25 122.31,35.19 | 126.62,52.62 124.88,52.62 122.31,55.19 | 126.62,52.62 130,52.62 SV3.3 | 122.31,55.19 120,57.5 SV28.1 | 128,62.5 130,62.5 SV4.3 | 128,62.5 123.38,57.88 123.38,56.25 122.31,55.19 | 126.62,52.62 126.62,44 127.75,42.88 128,42.5 | SV8.3 132.62,105 132.62,103.12 133.88,101.88 133.88,100 SV15.4 | 126.62,72.62 124.88,72.62 122.31,75.19 | 126.62,72.62 130,72.62 SV1.3 | 122.31,75.19 120,77.5 SV27.1 | 122.31,75.19 126.62,79.5 126.62,81.12 128,82.5 130,82.5 SV2.3 130.12,82.88 130.12,84.25 133.88,88 v133.88,92.25 | 126.62,72.62 126.62,64 127.75,62.88 128,62.5
  Top 0.9: v39,107.62 38.12,108.5 20.88,108.5 20,107.62 17.75,107.62 12.25,102.12 11.88,101.88
  Bottom 0.9: v128.75,19.88 127.38,21.25 125.5,21.25 121.62,17.38 SV26.1 | v133.88,92.25 133.88,100 SV15.4 | D1.A 92,85 96.25,89.25 110.88,89.25 116.62,83.5 116.62,79.12 118.38,77.38 SV27.1 | v39,107.62 75.62,107.62 76.38,108.38 80.75,108.38 82.62,106.5 82.62,105 SV9.3
VIN-ARDUINO  (via drill 1)
  Top 0.9: v49.62,56.12 35.75,42.25 33.75,42.25 28,48 17.62,48 15.75,49.88 15.75,55.5 16.25,56 16.25,57.5 15.25,58.5 12.5,58.5 7.38,53.38 6,53.38 X2.2
  Bottom 0.9: v49.62,56.12 49.62,56.62 54.62,61.62 56.12,61.62 67.38,50.38 67.38,49.75 IC1.6
VIN-SENSOR
  Bottom 0.9: U$2.+ 10.62,36.12 10.62,53.12 2.62,61.12 2.62,80.75 4.38,82.5 6,82.5 SV29.3
VIN-SERVO
  Top 0.9: SV23.2 103.5,45 | 103.5,45 SV22.2 | SV24.2 105,60 | 105,60 103.5,60 | 103.5,60 SV19.2 | 103.5,60 103.5,45 | R2.2 85,79.88 88.62,79.88 91.62,76.88 96.5,76.88 98.38,75 SV20.2 105,75 | 105,75 106.25,75 | 106.25,75 SV21.2 | 106.25,75 106.25,81.25 | 106.25,81.25 106.25,82.62 108.62,85 C2.+ | D1.C 102.12,85 105.88,81.25 106.25,81.25 | 105,75 105,60